# Altium project DC_DC converter.PrjPcb
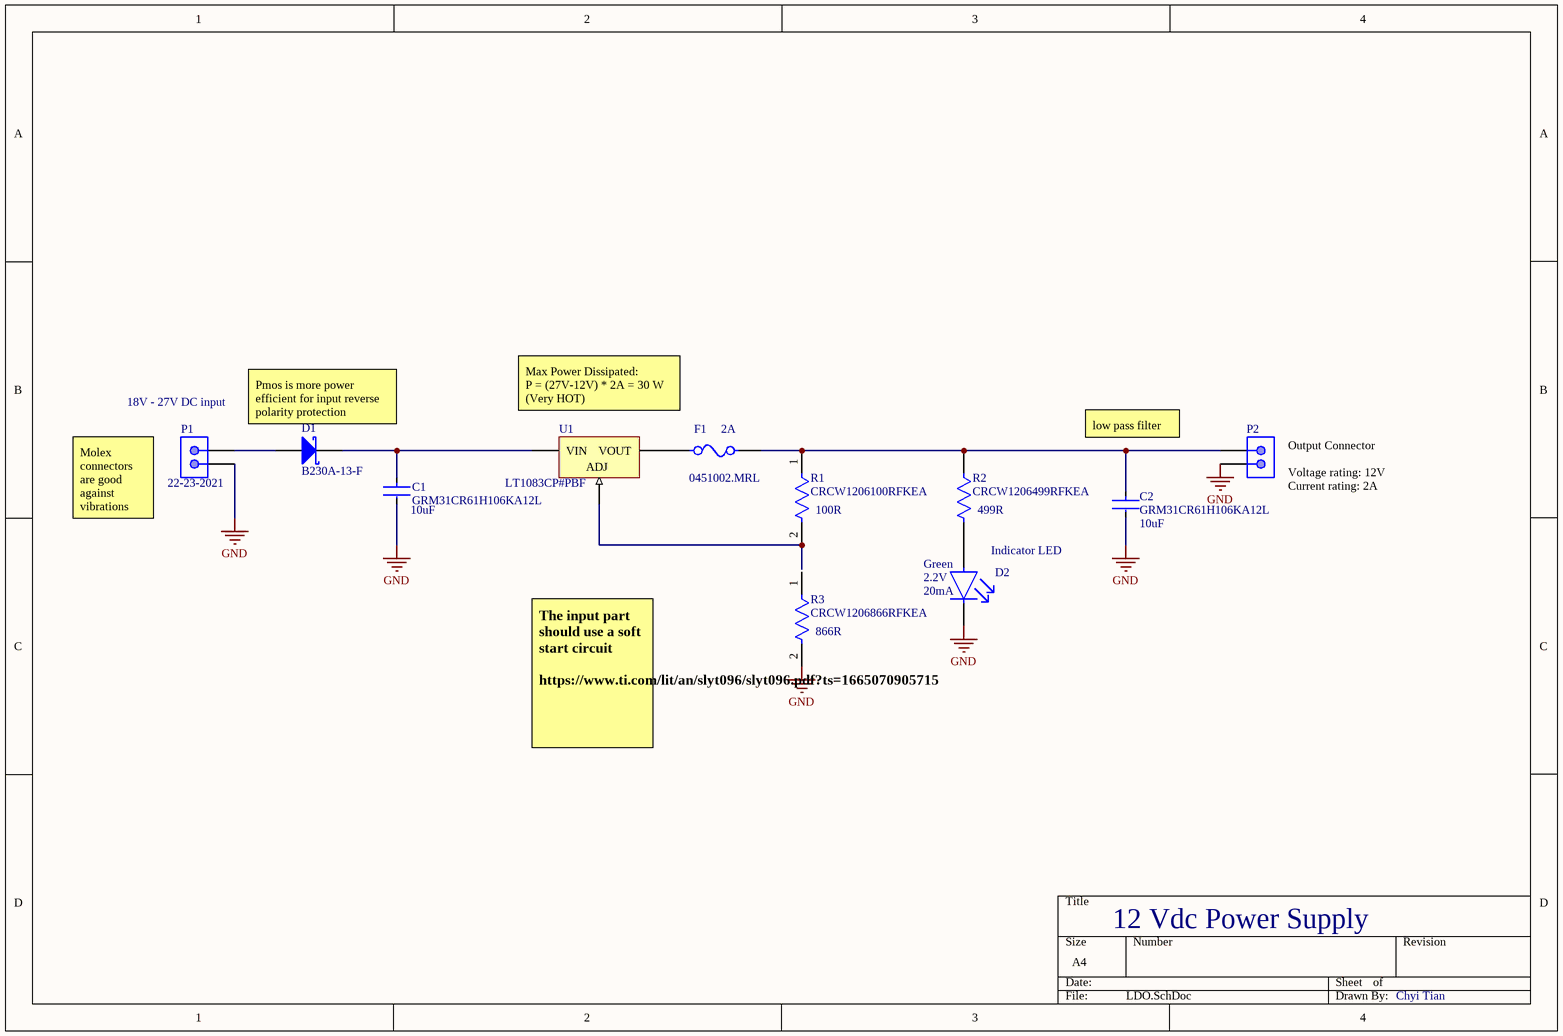
[diagram p0: LDO.SchDoc]
1 sheet, 11 parts. Net scope: global (net labels, ports and power ports of the same name join across sheets).
Board file: LDO.PcbDoc

## Sheet LDO.SchDoc
size A4; SheetNumber: 1; SheetTotal: 1

### Parts
C1  GRM31CR61H106KA12L  Capacitance: 10uF  [FP-GRM31-0_2-MFG]
C2  GRM31CR61H106KA12L  Capacitance: 10uF  [FP-GRM31-0_2-MFG]
D1  B230A-13-F  [DIOD-SMA-2_V]
D2  Forward Current: 20mA  Forward Voltage: 2.2V  Colour: Green  [FP-597-3301-507F-MFG]  (hidden comment: 597-3301-507F)
F1  0451002.MRL  Fuse Current: 2A  [FP-0451-MFG]
P1  22-23-2021  [MOLX-22-23-2021_V]
P2  22-23-2021  [MOLX-22-23-2021_V]  (value not drawn)
R1  CRCW1206100RFKEA  Resistance: 100R  [FP-CRCW1206-e3-MFG]
R2  CRCW1206499RFKEA  Resistance: 499R  [FP-CRCW1206-e3-IPC_B]
R3  CRCW1206866RFKEA  Resistance: 866R  [FP-CRCW1206-e3-MFG]
U1  LT1083CP#PBF  [LT-P-3-S-TO-247]

### Nets
GND: C1.2 C2.2 D2.1(C) P1.1 P2.2 R3.2
NetC1_1: C1.1 D1.2(K) U1.3(VIN)
NetC2_1: C2.1 F1.2 P2.1 R1.1 R2.1
NetD1_1: D1.1(A) P1.2
NetD2_2: D2.2(A) R2.2
NetF1_1: F1.1 U1.2(VOUT)
NetR1_2: R1.2 U1.1(ADJ)

Not connected (* = marked no-connect by the designer): R3 1

### Notes on the sheet
- (near P1) 18V - 27V DC input
- (near D1) Pmos is more power efficient for input reverse polarity protection
- Max Power Dissipated:
  P = (27V-12V) * 2A = 30 W
  (Very HOT)
- low pass filter
- Molex connectors are good against vibrations
- (near P2) Output Connector
  Voltage rating: 12V
  Current rating: 2A
- Indicator LED
- The input part should use a soft start circuit
  https://www.ti.com/lit/an/slyt096/slyt096.pdf?ts=1665070905715
- 12 Vdc Power Supply
- Chyi Tian

### Library data of the parts
C1 C2 = CMP-2000-05256-2: CAP CER 10UF 50V X5R 1206; Manufacturer: Murata Electronics North America; Tolerance: 10%; Temperature Coefficient: 15%; Material: Ceramic; Height: 1.8mm; Temperature: -55°C to +85°C; Lead Free: Yes; Temperature Characteristic: X5R; ComponentLink2Description: Datasheet; Digikey Description: CAP CER 10UF 50V X5R 1206; Octopart: https://octopart.com/grm31cr61h106ka12l-murata-18903335; Device Class L2: Capacitors; Automotive: No; Value: 10uF; Temperature Range High: +85°C; Temperature Range Low: -55°C; Device Class L3: Ceramic Capacitors; Voltage Rating: 50V; Device Class L1: Passive Components; Mouser Description: Multilayer Ceramic Capacitors MLCC - SMD/SMT 1206 10uF 50volt X5R +/-10%; ComponentLink2URL: https://search.murata.co.jp/Ceramy/image/img/A01X/G101/ENG/GRM31CR61H106KA12-01A.pdf; Manufacturer Part Number: GRM31CR61H106KA12L; Package: GRM31-0.2; RoHS: TRUE; Category: Cap
D1 = CMP-0905-00001-1: 2 A Surface Mount Schottky Barrier Rectifier, 30 V, -65 to 150 degC, 2-Pin SMA, RoHS, Tape and Reel; Manufacturer: Diodes Inc; VRRM: 30 V; IO: 2 A Max.; CT: 200 pF; IFSM: 50 A; VF: 0.5 V; IF: 2 A; ComponentLink1Description: Manufacturer URL; PackageDescription: 2-Pin SMA, Body 4.3 x 2.605 mm, Height 2.3 mm; Mounting Technology: Surface Mount; ComponentLink1URL: http://diodes.com/; VR: 30 V; PackageReference: SMA-2; RoHS: TRUE; ComponentLink2URL: http://diodes.com/datasheets/ds13004.pdf; Packing: Tape and Reel; DatasheetVersion: Rev. 21 - 2; ComponentLink2Description: Datasheet; Temperature Range: -65 to 150 degC; PartNumber: B230A-13-F
D2 = CMP-15384-000001-1: LED GREEN CLEAR 1208 SMD; Manufacturer: Dialight; Wavelength: 573nm; Luminous Intensity: 25mcd; Led Orientation: Top View; Power Dissipation: 70mW; Viewing Angle: 110°; Peak Emmision Wavelength: 570nm; RoHS: TRUE; Temperature Range High: +85°C; Octopart: https://octopart.com/597-3301-507f-dialight-117926; Device Class L3: unset; Device Class L1: Optoelectronics; Automotive: No; Lead Free: Yes; Manufacturer Part Number: 597-3301-507F; Height: 1.5mm; ComponentLink2Description: Datasheet; Temperature Range Low: -30°C; Mouser Description: Standard LEDs - SMD Green 563nm 16mcd 2.2V 104 deg; Device Class L2: LEDs; Temperature: -30°C to +85°C; Package: 597-3301-507F; ComponentLink2URL: http://www.dialightsignalsandcomponents.com/Assets/Drawings/2D_Drawings_DrawingDetailedSpec/C17290.pdf; Category: Diode; Digikey Description: LED GREEN CLEAR 1208 SMD
F1 = CMP-08605-000053-1: FUSE BOARD MNT 2A 125VAC/VDC SMD; Manufacturer: Littelfuse; Max Fuse Dc Voltage: 125V; Value: 0.0367Ω; Fuse Interrupt Ac Current: 50A; Fuse I2T: 0.53A2Sec; Fuse Blow Speed: Fast; Device Class L2: Fuses; Temperature Range High: +125°C; Category: Fuse; ComponentLink2URL: https://www.littelfuse.com/~/media/electronics/datasheets/fuses/littelfuse_fuse_451_453_datasheet.pdf.pdf; Automotive: No; Temperature Range Low: -55°C; Voltage Rating: 125V; ComponentLink2Description: Datasheet; Temperature: -55°C to +125°C; Device Class L3: unset; Height: 2.94mm; Lead Free: Yes; Resistance: 0.0367Ω; Max Fuse Ac Voltage: 125V; Fuse Interrupt Dc Current: 50A; RoHS: TRUE; Digikey Description: FUSE BOARD MNT 2A 125VAC/VDC SMD; Device Class L1: Circuit Protection; Octopart: https://octopart.com/0451002.mrl-littelfuse-566376; Mouser Description: Surface Mount Fuses 125V 2A; Package: 0451; Manufacturer Part Number: 0451002.MRL
P1 P2 = CMP-1704-00001-3: Male Header, Pitch 2.54 mm, 1 x 2 Position, Height 10.67 mm, Tail Length 3.56 mm, 0 to 75 degC, RoHS, Bulk; Package Quantity: 3000; Height: 10.67 mm; RoHSCompliant: True; ComponentLink2URL: https://datasheet.ciiva.com/19454/232266-19454304.pdf; PartNumber: 22-23-2021; Packaging: Bulk; ComponentLink2Description: Datasheet; Min Operating Temperature: 0 degC; ComponentLink1Description: Manufacturer URL; Length: 5.08 mm; Mounting Technology: Through Hole; Max Operating Temperature: 75 degC; REACH SVHC: Unknown; PackageDescription: Male Header, Pitch 2.54 mm, 1 x 2 Position, Height 10.67 mm, Tail Length 3.56 mm; ComponentLink1URL: http://www.molex.com/; Mount: Through Hole; Radiation Hardening: No; Width: 6.35 mm; Pins: 2
R1 = CMP-2003-04801-2: RES Thick Film, 100Ω, 1%, 0.25W, 100ppm/°C, 1206; Voltage Rating (DC): 200V; Power Rating: 250mW; Case Code (Metric): 3216; Radiation Hardening: No; Height: 0.55mm; Packaging: Tape and Reel; Depth: 1.6mm; Weight: 0.000353oz; Termination: SMD/SMT; Lead Free: Lead Free; Min Operating Temperature: -55°C; Contact Plating: Tin; Max Operating Temperature: 155°C; Case Code (Imperial): 1206; Military Standard: Not; Width: 1.6mm; Number of Pins: 2; Voltage Rating: 200V; Composition: Thick Film; Package Quantity: 5000; Tolerance: 1%; Case/Package: 1206; Mount: Surface Mount; Length: 3.2mm; Temperature Coefficient: 100ppm/°C
R2 = CMP-2003-02225-2: RES Thick Film, 499Ω, 1%, 0.25W, 100ppm/°C, 1206; Power Rating: 250mW; Voltage Rating (DC): 200V; Length: 3.2mm; Lead Free: Lead Free; Weight: 0.000353oz; Tolerance: 1%; Case Code (Metric): 3216; Package Quantity: 5000; Height: 0.55mm; Termination: SMD/SMT; Max Operating Temperature: 155°C; Military Standard: Not; Depth: 1.6mm; Mount: Surface Mount; Radiation Hardening: No; Case Code (Imperial): 1206; Min Operating Temperature: -55°C; Composition: Thick Film; Contact Plating: Tin; Packaging: Tape and Reel; Temperature Coefficient: 100ppm/°C; Voltage Rating: 200V; Case/Package: 1206; Width: 1.6mm
R3 = CMP-2003-02411-2: RES Thick Film, 866Ω, 1%, 0.25W, 100ppm/°C, 1206; Power Rating: 250mW; Voltage Rating (DC): 200V; Case/Package: 1206; Tolerance: 1%; Case Code (Imperial): 1206; Contact Plating: Tin; Depth: 1.6mm; Radiation Hardening: No; Min Operating Temperature: -55°C; Package Quantity: 10; Max Power Dissipation: 250mW; Termination: SMD/SMT; Width: 1.6mm; Weight: 0.000353oz; Number of Pins: 2; Military Standard: Not; Voltage Rating: 200V; Composition: Thick Film; Features: Automotive AEC-Q200; Max Operating Temperature: 155°C; Length: 3.2mm; Temperature Coefficient: 100ppm/°C; Packaging: Tape and Reel; Height: 0.024inch; Case Code (Metric): 3216; Lead Free: Lead Free; Number of Terminations: 2
U1 = CMP-0476-00995-1: 7.5 A Low Dropout Positive Regulator, 2.55 to 30 V Vin, Adjustable Vout, 3-pin FM (P-3), 0 to 150 degC, Pb-Free; Manufacturer: Linear Technology; Vin Min(V): 2.55; Vout Max(V): 28.5; Output Voltage: Adj; Isupply(mA): 5; Dropout Voltage(V): 1.3; Discrete Pass Element: no; Vout Min(V): 1.25; Number of Outputs: 1; Vin Max(V): 30; Iout(mA): 7500; DatasheetVersion: Rev. G; ComponentLink3URL: http://cds.linear.com/docs/en/packaging/P3(TO-3P)%2005-08-1450%20Rev%20A.pdf; PackageReference: P-3; RoHS: TRUE; ComponentLink2URL: http://cds.linear.com/docs/en/datasheet/108345fg.pdf; ComponentLink1URL: http://www.linear.com/; Mounting Technology: Through Hole; PartNumber: LT1083CP#PBF; PackageDescription: 3-Pin Plastic TO-3P, Body 16.005 x 5.005 mm, Pitch 5.46 mm; ComponentLink1Description: Manufacturer URL; PackageVersion: Rev. A, 06/2012; ComponentLink3Description: Package Specification; ComponentLink2Description: Datasheet